# Altium schematic sheet MCU_USB_Interface.SchDoc: MCU USB INTERFACE
size A4; DocumentNumber: 13; SheetNumber: 13; SheetTotal: 18
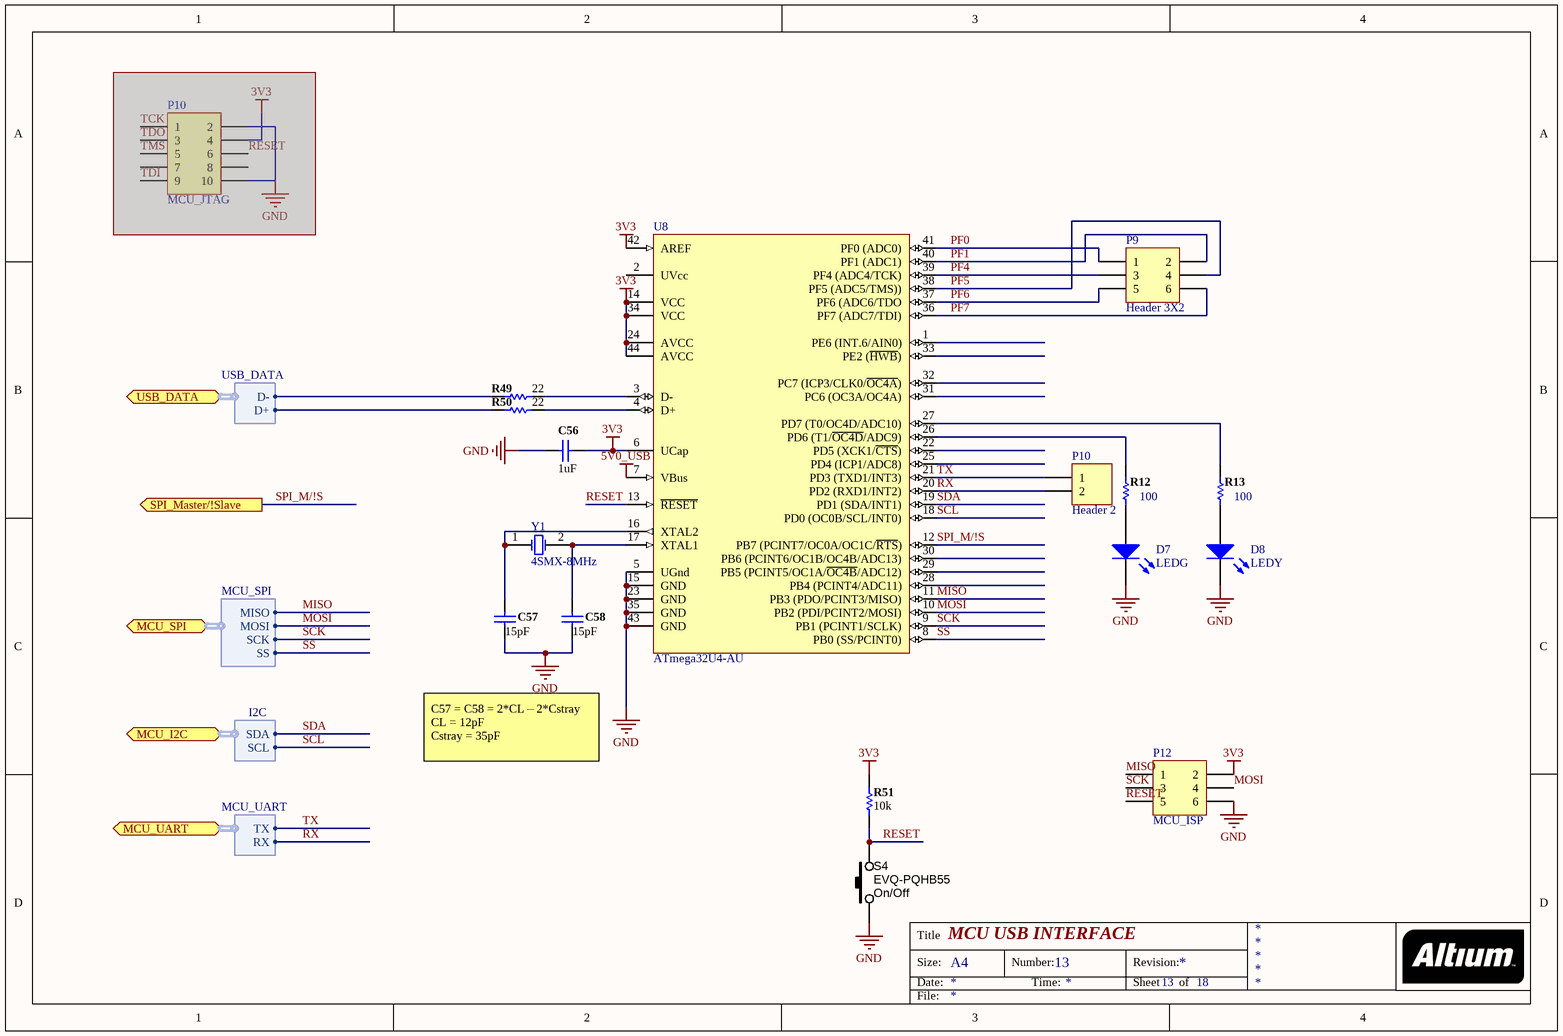
[diagram p0: MCU_USB_Interface.SchDoc]

## Parts
(Parts that share a designator on the sheet are numbered #1, #2 ... from top to bottom, then left to right.)
C56  1uF  [0805C-GENERIC]
C57  15pF  [0805C-GENERIC]
C58  15pF  [0805C-GENERIC]
D7  LEDG  [LED-0805-K]
D8  LEDY  [LED-0805-K]
P9  Header 3X2  [HDR2X3]
P10#1  MCU_JTAG  [10P_PCB_HEADER_BRD_MNT]  (masked out: inside a compile mask, not in the netlist)
P10#2  Header 2  [HEADER-1X2]
P12  Header 3X2  [HDR2X3]  (value not drawn)
R12  100  [0805R-100]
R13  100  [0805R-100]
R49  22  [0805R-22]
R50  22  [0805R-22]
R51  10k  [0805R-10K]
S4  Function: On/Off  [TACT-SWITCH-TS1150]  (hidden comment: EVQ-PQHB55)
U8  ATmega32U4-AU  [44ML_N]
Y1  4SMX-8MHz  [4SMX]

## Ports
MCU_I2C (harness I2C), MCU_SPI (harness MCU_SPI), MCU_UART (harness MCU_UART), SPI_Master/!Slave (out), USB_DATA (harness USB_DATA)

## Harnesses
USB_DATA: D-, D+
MCU_SPI: MISO, MOSI, SCK, SS
I2C: SDA, SCL
MCU_UART: TX, RX

## Nets
3V3: C56.2 P12.2 R51.2 U8.6(UCap) U8.14(VCC) U8.24(AVCC) U8.34(VCC) U8.42(AREF) U8.44(AVCC)
5V0_USB: U8.7(VBus)
GND: C56.1 C57.1 C58.1 D7.K D8.K P12.6 S4.1 U8.5(UGnd) U8.15(GND) U8.23(GND) U8.35(GND) U8.43(GND)
MISO: P12.1 U8.11(PB3_(PDO/PCINT3/MISO)) ; port MCU_SPI.MISO
MOSI: P12.4 U8.10(PB2_(PDI/PCINT2/MOSI)) ; port MCU_SPI.MOSI
PF0: P9.1 U8.41(PF0_(ADC0))
PF1: P9.2 U8.40(PF1_(ADC1))
PF4: P9.3 U8.39(PF4_(ADC4/TCK))
PF5: P9.4 U8.38(PF5_(ADC5/TMS)))
PF6: P9.5 U8.37(PF6_(ADC6/TDO)
PF7: P9.6 U8.36(PF7_(ADC7/TDI))
RESET: P12.5 R51.1 S4.2 U8.13(~{RESET})
RX: P10#2.2 U8.20(PD2_(RXD1/INT2)) ; port MCU_UART.RX
SCK: P12.3 U8.9(PB1_(PCINT1/SCLK)) ; port MCU_SPI.SCK
SCL: U8.18(PD0_(OC0B/SCL/INT0)) ; port MCU_I2C.SCL
SDA: U8.19(PD1_(SDA/INT1)) ; port MCU_I2C.SDA
SPI_M/!S: U8.12(PB7_(PCINT7/OC0A/OC1C/~{RTS})) ; port SPI_Master/!Slave
SS: U8.8(PB0_(SS/PCINT0)) ; port MCU_SPI.SS
TX: P10#2.1 U8.21(PD3_(TXD1/INT3)) ; port MCU_UART.TX
NetC57_2: C57.2 U8.16(XTAL2) Y1.1(OSC1)
NetC58_2: C58.2 U8.17(XTAL1) Y1.2(OSC2)
NetD7_A: D7.A R12.1
NetD8_A: D8.A R13.1
NetR12_2: R12.2 U8.26(PD6_(T1/~{OC4D}/ADC9))
NetR13_2: R13.2 U8.27(PD7_(T0/OC4D/ADC10))
NetR49_1: R49.1 ; port USB_DATA.D-
NetR49_2: R49.2 U8.3(D-)
NetR50_1: R50.1 ; port USB_DATA.D+
NetR50_2: R50.2 U8.4(D+)

Not connected (* = marked no-connect by the designer): U8 1(PE6_(INT.6/AIN0)) 2(UVcc) 22(PD5_(XCK1/~{CTS})) 25(PD4_(ICP1/ADC8)) 28(PB4_(PCINT4/ADC11)) 29(PB5_(PCINT5/OC1A/~{OC4B}/ADC12)) 30(PB6_(PCINT6/OC1B/OC4B/ADC13)) 31(PC6_(OC3A/OC4A)) 32(PC7_(ICP3/CLK0/~{OC4A})) 33(PE2_(~{HWB}))

## Notes on the sheet
- C57 = C58 = 2*CL – 2*Cstray
  CL = 12pF
  Cstray = 35pF
- (near P12) MCU_ISP
- Title
- Size:
- Date:
- A4
- Number:
- Time:
- Revision:
- Sheet
- of
- File:

## Library data of the parts
C56-C58 = D-101-0027: Capacitor, Ceramic, 10% 10V 0805 X7R; Polarity: Non-Polarized; Dielectric: X7R; Mounting Technology: Surface Mount; Rated Voltage: 10 V; Status: Production; Technology: Ceramic; Tolerance: 10 %; Category: Capacitor
  C56: Capacitance: 1uF
  C57 C58: Capacitance: 15pF
D7 D8 = LED2: Typical RED, GREEN, YELLOW, AMBER GaAs LED; Published: 8-Jun-2000; LatestRevisionDate: 17-Jul-2002; LatestRevisionNote: Re-released for DXP Platform.; PackageVersion: Feb-2002; PackageReference: 3.2X1.6X1.1; Publisher: Altium Limited; PackageDescription: SM LED; 2 Flat Leads
P9 P12 = Header 3X2: Header, 3-Pin, Dual row; LatestRevisionDate: 17-Jul-2002; LatestRevisionNote: Re-released for DXP Platform.; Publisher: Altium Limited
P10#1 = Header 5X2: Header, 5-Pin, Dual row; LatestRevisionDate: 17-Jul-2002; LatestRevisionNote: Re-released for DXP Platform.; Publisher: Altium Limited
P10#2 = Header 2: Header, 2-Pin; LatestRevisionDate: 17-Jul-2002; LatestRevisionNote: Re-released for DXP Platform.; Publisher: Altium Limited
R12 R13 R49-R51 = D-100-0116: Tolerance: 1 %; Mounting Technology: Surface Mount; Status: Production; Category: Resistor
  R12 R13: Value: 100
  R49 R50: Value: 22
  R51: Value: 10k
S4 = SW_EVQ-PQHB55: Low-profile captive tact switch; Manufacturer 1: Panasonic - ECG; Ratings: 1.6 Newton; Switch Function: Off-Mom; Contact Rating @ Voltage: 0.02A @ 15VDC; Outline: 4.50mm x 4.50mm; Operating Force: 160gf; SCDType: spec; Package / Case: per dwg; Supplier 1: Digi-Key; Supplier Part Number 1: P8090SCT-ND; Mounting Type: Surface Mount; Orientation: Vertical; ComponentLink1URL: http://industrial.panasonic.com/www-data/pdf/ATK0000/ATK0000CE1.pdf; ComponentLink1Description: http://industrial.panasonic.com/www-data/pdf/ATK0000/ATK0000CE1.pdf; Manufacturer Part Number 1: EVQ-PQHB55
U8 = ATmega32U4-AU: 8-bit AVR Microcontroller, 2.7-5.5V, 16MHz, 32KB Flash, 1KB EEPROM, 2.5KB SRAM, USB Controller, 44-pin TQFP, Industrial Grade (-40°C to 85°C), Ext Osc; DatasheetVersion: revF, Nov-2010; PackageVersion: rev.G, Jul-2007; PackageReference: 44ML; PackageDescription: 44-Pin Plastic Thin Quad Flat Pack, 10 x 10 x 1.0 mm Body, 0.8 mm Pitch (TQFP); ComponentLink1Description: Manufacturer URL; ComponentLink1URL: http://www.atmel.com/; ComponentLink2Description: ATmega16U4/32U4 Datasheet; ComponentLink2URL: http://www.atmel.com/dyn/resources/prod_documents/doc7766.pdf; ComponentLink3Description: ATmega16U4 ATmega32U4 Summary; ComponentLink3URL: http://www.atmel.com/dyn/resources/prod_documents/7766S.pdf
Y1 = 4SMX: Surface Mount Quartz Crystal; Note: PCB layout complies with manufacturer's recommendation.; Published: 17-Jul-2002; DatasheetDocument: 9-Sep-1999; PackageDocument: 9-Sep-1999; PackageReference: 4SMX; Publisher: Altium Limited; ComponentLink1Description: Manufacturer Link; ComponentLink1URL: http://www.cmac.com/mt/